# Altium schematic sheet Modules.SchDoc
size A3; SheetNumber: 3; SheetTotal: 3
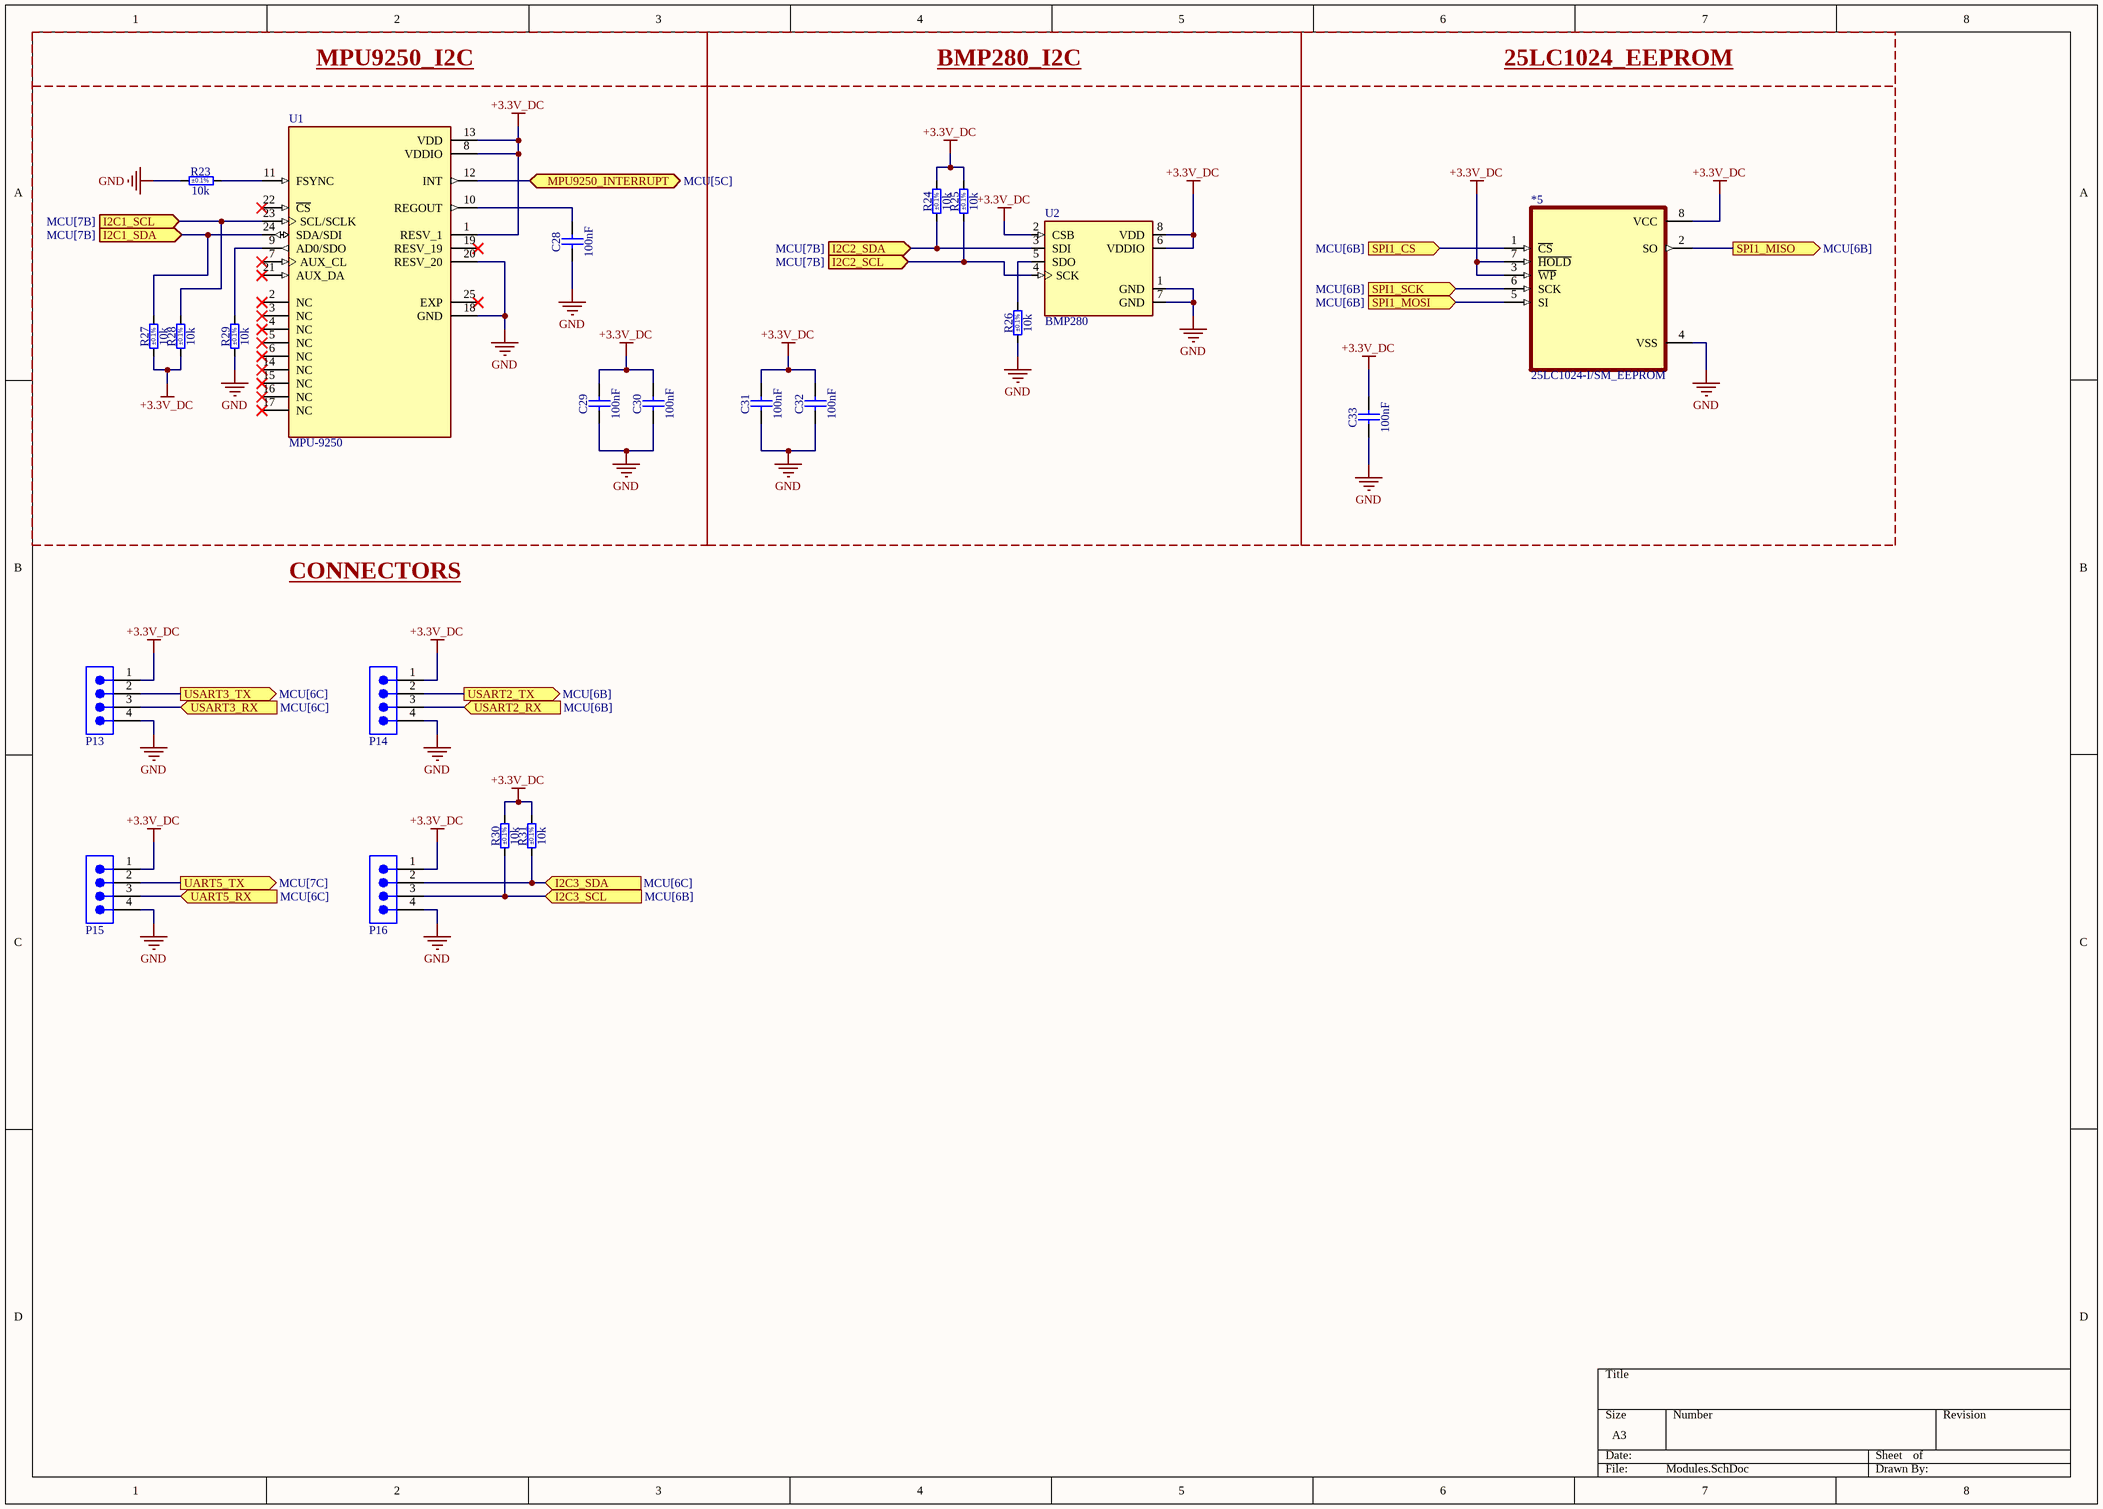
[diagram p0: Modules.SchDoc]

## Parts
*5  25LC1024-I/SM_EEPROM  [25LC1024-I/SM_EEPROM]
C28  100nF  [CAPC2012X135N]
C29  100nF  [CAPC2012X135N]
C30  100nF  [CAPC2012X135N]
C31  100nF  [CAPC2012X135N]
C32  100nF  [CAPC2012X135N]
C33  100nF  [CAPC2012X135N]
P13  691322310004  [691322310004]  (value not drawn)
P14  691322310004  [691322310004]  (value not drawn)
P15  691322310004  [691322310004]  (value not drawn)
P16  691322310004  [691322310004]  (value not drawn)
R23  10k  Tolerance: ±0.1%  [RESC2012X60N]
R24  10k  Tolerance: ±0.1%  [RESC2012X60N]
R25  10k  Tolerance: ±0.1%  [RESC2012X60N]
R26  10k  Tolerance: ±0.1%  [RESC2012X60N]
R27  10k  Tolerance: ±0.1%  [RESC2012X60N]
R28  10k  Tolerance: ±0.1%  [RESC2012X60N]
R29  10k  Tolerance: ±0.1%  [RESC2012X60N]
R30  10k  Tolerance: ±0.1%  [RESC2012X60N]
R31  10k  Tolerance: ±0.1%  [RESC2012X60N]
U1  MPU-9250  [QFN40P300X300X105-25N]
U2  BMP280  [XDCR_BMP280]

## Blocks framed on the sheet
MPU9250_I2C: C28-C30 R23 R27-R29 U1

## Ports
I2C1_SCL (in, see MCU[7B]), I2C1_SDA (in, see MCU[7B]), I2C2_SCL (in, see MCU[7B]), I2C2_SDA (in, see MCU[7B]), I2C3_SCL (in, see MCU[6B]), I2C3_SDA (in, see MCU[6C]), MPU9250_INTERRUPT (bidir, see MCU[5C]), SPI1_CS (in, see MCU[6B]), SPI1_MISO (out, see MCU[6B]), SPI1_MOSI (in, see MCU[6B]), SPI1_SCK (in, see MCU[6B]), UART5_RX (in, see MCU[6C]), UART5_TX (out, see MCU[7C]), USART2_RX (in, see MCU[6B]), USART2_TX (out, see MCU[6B]), USART3_RX (in, see MCU[6C]), USART3_TX (out, see MCU[6C])

## Nets
+3.3V_DC: *5.3(~{WP}) *5.7(~{HOLD}) *5.8(VCC) C29.2 C30.2 C31.2 C32.2 C33.2 P13.1 P14.1 P15.1 P16.1 R24.2 R25.2 R27.1 R28.1 R30.2 R31.2 U1.1(RESV_1) U1.8(VDDIO) U1.13(VDD) U2.2(CSB) U2.6(VDDIO) U2.8(VDD)
GND: *5.4(VSS) C28.1 C29.1 C30.1 C31.1 C32.1 C33.1 P13.4 P14.4 P15.4 P16.4 R23.1 R26.1 R29.1 U1.18(GND) U1.20(RESV_20) U2.1(GND) U2.7(GND)
I2C1_SCL: R28.2 U1.23(SCL/SCLK) ; port I2C1_SCL
I2C1_SDA: R27.2 U1.24(SDA/SDI) ; port I2C1_SDA
I2C2_SCL: R25.1 U2.4(SCK) ; port I2C2_SCL
I2C2_SDA: R24.1 U2.3(SDI) ; port I2C2_SDA
I2C3_SCL: P16.3 R30.1 ; port I2C3_SCL
I2C3_SDA: P16.2 R31.1 ; port I2C3_SDA
MPU9250_INTERRUPT: U1.12(INT) ; port MPU9250_INTERRUPT
SPI1_CS: *5.1(~{CS}) ; port SPI1_CS
SPI1_MISO: *5.2(SO) ; port SPI1_MISO
SPI1_MOSI: *5.5(SI) ; port SPI1_MOSI
SPI1_SCK: *5.6(SCK) ; port SPI1_SCK
UART5_RX: P15.3 ; port UART5_RX
UART5_TX: P15.2 ; port UART5_TX
USART2_RX: P14.3 ; port USART2_RX
USART2_TX: P14.2 ; port USART2_TX
USART3_RX: P13.3 ; port USART3_RX
USART3_TX: P13.2 ; port USART3_TX
NetC28_2: C28.2 U1.10(REGOUT)
NetR23_2: R23.2 U1.11(FSYNC)
NetR26_2: R26.2 U2.5(SDO)
NetR29_2: R29.2 U1.9(AD0/SDO)

Not connected (* = marked no-connect by the designer): U1 2(NC)* 3(NC)* 4(NC)* 5(NC)* 6(NC)* 7(AUX_CL)* 14(NC)* 15(NC)* 16(NC)* 17(NC)* 19(RESV_19)* 21(AUX_DA)* 22(~{CS})* 25(EXP)*

## Notes on the sheet
- BMP280_I2C
- 25LC1024_EEPROM
- CONNECTORS

## Library data of the parts
C28-C33 = CC0805_100NF_50V_10%_X7R: Non-polarised capacitor; Part Description: SMD Multilayer Chip Ceramic Capacitor; Manufacturer: GENERIC; Manufacturer1 Part Number: C2012X7R1H104K085; Voltage: 50V; TC: X7R; Tolerance: ±10%; Part Number: CC0805_100NF_50V_10%_X7R; Component Kind: Standard; Component Type: Standard; Pin Count: 2; Value: 100nF; Status: None; Manufacturer Part Number: CC0805_100NF_50V_10%_X7R; Case: 0805; Mounted: Yes; Socket: No; SMD: Yes; Sense: No; Manufacturer1 Example: TDK; Manufacturer1 ComponentHeight: 1mm; HelpURL: \\cern.ch\dfs\Applications\Altium\Datasheets\CC0805_X7R_TDK_C.pdf; Author: CERN DEM JLC; CreateDate: 3.12.2007; LatestRevisionDate: 22.04.2015
P13-P16 = 691322310004: WR-TBL Series 322 Horizontal PCB Header, THT, pitch 3.81mm, 4p; Manufacturer: Wurth Elektronik; Modularity: No; Rated Current: 10A; Working Voltage: 300V; Manufacturer Part Number: 691322310004; Category: Terminal Blocks; Match Code: WR-TBL; ComponentLink1Description: Website Link; ComponentLink1URL: https://www.we-online.com/redexpert/article/691322310004?ad; ComponentLink2Description: Datasheet Link; ComponentLink2URL: https://www.we-online.com/redexpert/spec/691322310004?ad; Mount: Through Hole; Operating Temperature Max: 105°C; Operating Temperature Min: -40°C; Packaging: Box; Application: Pluggable; Number of Pins: 4; Number of Rows: 1; Orientation: Horizontal; Pitch: 3.81mm
R23-R31 = R0805_10K_0.1%_0.1W_10PPM: Resistor - 0.1%; Part Description: Thin Film Chip Resistor; Manufacturer: GENERIC; Manufacturer1 Part Number: RN73C2A10KBTG; Power: 0.1W; TC: ±10ppm; PressFit: No; Part Number: R0805_10K_0.1%_0.1W_10PPM; Component Kind: Standard; Component Type: Standard; Pin Count: 2; Value: 10k; Status: Not Recommended; Manufacturer Part Number: R0805_10K_0.1%_0.1W_10PPM; Case: 0805; Mounted: Yes; Sense: No; Socket: No; SMD: Yes; Manufacturer1 Example: TYCO HOLSWORTHY; Manufacturer1 ComponentHeight: 0.6mm; HelpURL: \\cern.ch\dfs\Applications\Altium\Datasheets\R0805_Tyco_RN73.pdf; Author: CERN DEM JLC; CreateDate: 3.12.2007; LatestRevisionDate: 13.03.2008
U1 = MPU-9250: MPU-9250 series Accelerometer, Gyroscope, Humidity, Magnetometer, Pressure, Temperature Sensor Evaluation Board; MF: TDK InvenSense; SnapEDA_Link: https://www.snapeda.com/parts/MPU-9250/TDK+InvenSense/view-part/?ref=snap; Package: TFQFN-24 TDK InvenSense; Value: *; MP: MPU-9250; Check_prices: https://www.snapeda.com/parts/MPU-9250/TDK+InvenSense/view-part/?ref=eda
U2 = BMP280: BMP280 Absolute Barometric Pressure Sensor for Battery Powered Devices 2 x 2.5mm; Package: None; Availability: Unavailable; MP: BMP280; Value: *; Price: None